# EAGLE design rStep_v3_seedstudio (EAGLE 5.10)
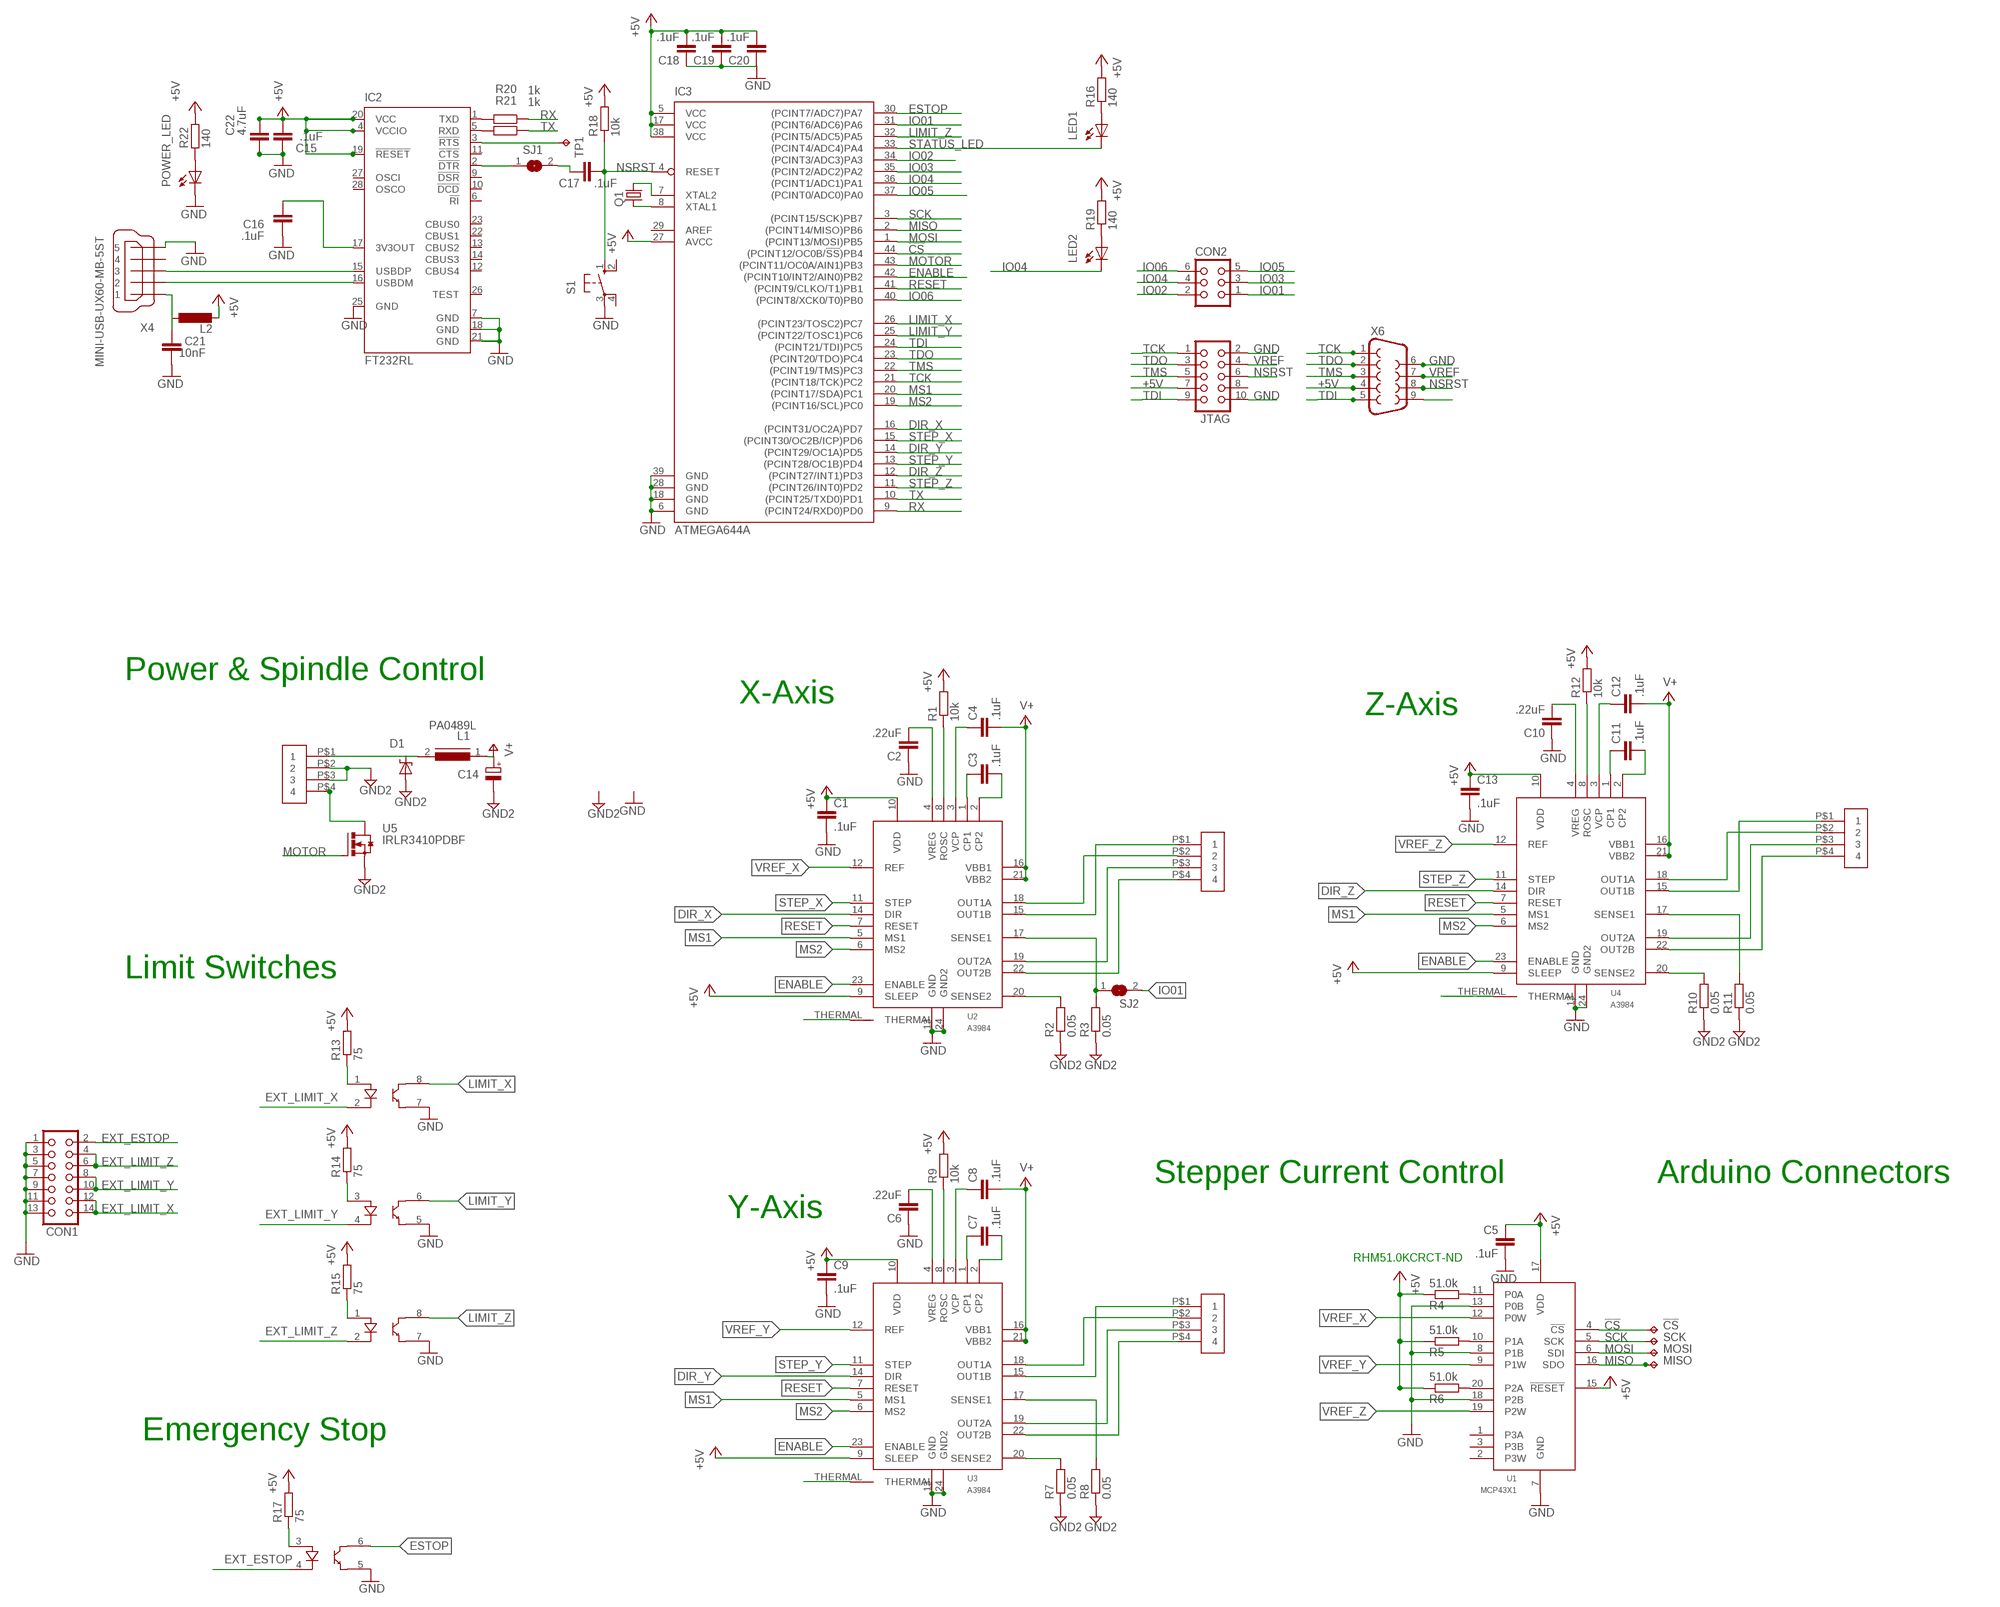
[diagram p0: schematic, sheet 1]

## Parts
!CS  TPB1,27  [B1,27]
C1  .1uF  C-EUC0805  [C0805]
C2  .22uF  C-EUC0805  [C0805]
C3  .1uF  C-EUC0805  [C0805]
C4  .1uF  C-EUC0805  [C0805]
C5  .1uF  C-EUC0805  [C0805]
C6  .22uF  C-EUC0805  [C0805]
C7  .1uF  C-EUC0805  [C0805]
C8  .1uF  C-EUC0805  [C0805]
C9  .1uF  C-EUC0805  [C0805]
C10  .22uF  C-EUC0805  [C0805]
C11  .1uF  C-EUC0805  [C0805]
C12  .1uF  C-EUC0805  [C0805]
C13  .1uF  C-EUC0805  [C0805]
C14  CPOL-EUE5-10.5  [E5-10,5]
C15  .1uF  C-EUC0805  [C0805]
C16  .1uF  C-EUC0805  [C0805]
C17  .1uF  C-EUC0805  [C0805]
C18  .1uF  C-EUC0805  [C0805]
C19  .1uF  C-EUC0805  [C0805]
C20  .1uF  C-EUC0805  [C0805]
C21  10nF  C-EUC0805  [C0805]
C22  4.7uF  C-EUC0805  [C0805]
CON1  CON14  [CON14]
CON2  CON06  [CON06]
D1  SUPPRESSOR-SMBJ  [SMBJ]
IC2  FT232RL  [SSOP28]
IC3  ATMEGA644A  [TQFP44]
JTAG  CON10  [CON10]
L1  PA0489L  [PA0489L]
L2  L-EUL2012C  [L2012C]
LED1  LEDCHIP-LED0805  [CHIP-LED0805]
LED2  LEDCHIP-LED0805  [CHIP-LED0805]
MISO  TPB1,27  [B1,27]
MOSI  TPB1,27  [B1,27]
POWER_LED  LEDCHIP-LED0805  [CHIP-LED0805]
Q1  CRYSTAL  [CSTCE_V_C]
R1  10k  R-EU_R0805  [R0805]
R2  0.05  R-EU_R0805  [R0805]
R3  0.05  R-EU_R0805  [R0805]
R4  51.0k  R-EU_R0805  [R0805]
R5  51.0k  R-EU_R0805  [R0805]
R6  51.0k  R-EU_R0805  [R0805]
R7  0.05  R-EU_R0805  [R0805]
R8  0.05  R-EU_R0805  [R0805]
R9  10k  R-EU_R0805  [R0805]
R10  0.05  R-EU_R0805  [R0805]
R11  0.05  R-EU_R0805  [R0805]
R12  10k  R-EU_R0805  [R0805]
R13  75  R-EU_R0805  [R0805]
R14  75  R-EU_R0805  [R0805]
R15  75  R-EU_R0805  [R0805]
R16  140  R-EU_R0805  [R0805]
R17  75  R-EU_R0805  [R0805]
R18  10k  R-EU_R0805  [R0805]
R19  140  R-EU_R0805  [R0805]
R20  1k  R-EU_R0805  [R0805]
R21  1k  R-EU_R0805  [R0805]
R22  140  R-EU_R0805  [R0805]
S1  10-XX  [B3F-10XX]
SCK  TPB1,27  [B1,27]
SJ1  SJ  [SJ]
SJ2  SJ  [SJ]
TP1  TPB2,54  [B2,54]
U1  MCP43X1  [TSSOP20]
U2  A3984  [TSSOP24]
U3  A3984  [TSSOP24]
U4  A3984  [TSSOP24]
U5  IRLR3410PDBF  [TO252]
U6  LTV-827S  [ISOLATOR_8PIN]
U7  LTV-827S  [ISOLATOR_8PIN]
X1  284392-4  [284392-4]
X2  284392-4  [284392-4]
X3  284392-4  [284392-4]
X4  MINI-USB-UX60-MB-5ST  [UX60-MB-5ST]
X5  OSTTC04262  [OSTTC042162]
X6  F09D  [F09D]

## Nets
!CS: !CS.TP IC3.44((PCINT12/OC0B/!SS!)PB4) U1.4(!CS)
+5V: C1.1 C5.1 C9.1 C13.1 C15.2 C18.2 C19.2 C20.2 C22.1 IC2.4(VCCIO) IC2.19(!RESET) IC2.20(VCC) IC3.5(VCC) IC3.17(VCC) IC3.27(AVCC) IC3.38(VCC) JTAG.7 L2.2 R1.2 R4.1 R5.1 R6.1 R9.2 R12.2 R13.2 R14.2 R15.2 R16.2 R17.2 R18.2 R19.2 R22.2 U1.15(!RESET) U1.17(VDD) U2.9(SLEEP) U2.10(VDD) U3.9(SLEEP) U3.10(VDD) U4.9(SLEEP) U4.10(VDD) X6.4
DIR_X: IC3.16((PCINT31/OC2A)PD7) U2.14(DIR)
DIR_Y: IC3.14((PCINT29/OC1A)PD5) U3.14(DIR)
DIR_Z: IC3.12((PCINT27/INT1)PD3) U4.14(DIR)
ENABLE: IC3.42((PCINT10/INT2/AIN0)PB2) U2.23(ENABLE) U3.23(ENABLE) U4.23(ENABLE)
ESTOP: IC3.30((PCINT7/ADC7)PA7) U7.6(C)
EXT_ESTOP: CON1.2 U7.4(K)
EXT_LIMIT_X: CON1.12 CON1.14 U6.2(K)
EXT_LIMIT_Y: CON1.8 CON1.10 U6.4(K)
EXT_LIMIT_Z: CON1.4 CON1.6 U7.2(K)
GND: C1.2 C2.1 C5.2 C6.1 C9.2 C10.1 C13.2 C15.1 C16.1 C18.1 C19.1 C20.1 C21.1 C22.2 CON1.1 CON1.3 CON1.5 CON1.7 CON1.9 CON1.11 CON1.13 IC2.7(GND) IC2.18(GND) IC2.21(GND) IC2.25(GND) IC3.6(GND) IC3.18(GND) IC3.28(GND) IC3.39(GND) JTAG.2 JTAG.10 POWER_LED.C S1.3(P) U1.7(GND) U1.8(P1B) U1.13(P0B) U1.18(P2B) U2.13(GND) U2.24(GND2) U3.13(GND) U3.24(GND2) U4.13(GND) U4.24(GND2) U6.5(E) U6.7(E) U7.5(E) U7.7(E) X4.5 X6.6
GND2: C14.- D1.A R2.1 R3.1 R7.1 R8.1 R10.1 R11.1 U5.2(S) X5.P$2 X5.P$3
IO01: CON2.1 IC3.31((PCINT6/ADC6)PA6) SJ2.2
IO02: CON2.2 IC3.34((PCINT3/ADC3)PA3)
IO03: CON2.3 IC3.35((PCINT2/ADC2)PA2)
IO04: CON2.4 IC3.36((PCINT1/ADC1)PA1) LED2.C
IO05: CON2.5 IC3.37((PCINT0/ADC0)PA0)
IO06: CON2.6 IC3.40((PCINT8/XCK0/T0)PB0)
LIMIT_X: IC3.26((PCINT23/TOSC2)PC7) U6.8(C)
LIMIT_Y: IC3.25((PCINT22/TOSC1)PC6) U6.6(C)
LIMIT_Z: IC3.32((PCINT5/ADC5)PA5) U7.8(C)
MISO: IC3.2((PCINT14/MISO)PB6) MISO.TP U1.16(SDO)
MOSI: IC3.1((PCINT13/MOSI)PB5) MOSI.TP U1.6(SDI)
MOTOR: IC3.43((PCINT11/OC0A/AIN1)PB3) U5.1(G)
MS1: IC3.20((PCINT17/SDA)PC1) U2.5(MS1) U3.5(MS1) U4.5(MS1)
MS2: IC3.19((PCINT16/SCL)PC0) U2.6(MS2) U3.6(MS2) U4.6(MS2)
N$1: C2.2 U2.4(VREG)
N$2: C3.1 U2.1(CP1)
N$3: C3.2 U2.2(CP2)
N$4: C4.1 U2.3(VCP)
N$5: U2.18(OUT1A) X1.P$2
N$6: U2.15(OUT1B) X1.P$1
N$7: U2.19(OUT2A) X1.P$3
N$8: U2.22(OUT2B) X1.P$4
N$9: R1.1 U2.8(ROSC)
N$10: C6.2 U3.4(VREG)
N$11: C7.1 U3.1(CP1)
N$12: C7.2 U3.2(CP2)
N$13: C8.1 U3.3(VCP)
N$14: U3.18(OUT1A) X2.P$2
N$15: U3.15(OUT1B) X2.P$1
N$16: C17.2 SJ1.2
N$17: R2.2 U2.20(SENSE2)
N$18: U3.19(OUT2A) X2.P$3
N$19: R4.2 U1.11(P0A)
N$20: R5.2 U1.10(P1A)
N$21: R6.2 U1.20(P2A)
N$22: U3.22(OUT2B) X2.P$4
N$23: R8.2 U3.17(SENSE1)
N$24: R7.2 U3.20(SENSE2)
N$25: R9.1 U3.8(ROSC)
N$26: C10.2 U4.4(VREG)
N$27: C11.1 U4.1(CP1)
N$28: C11.2 U4.2(CP2)
N$29: C12.1 U4.3(VCP)
N$30: U4.18(OUT1A) X3.P$2
N$31: U4.15(OUT1B) X3.P$1
N$32: U4.19(OUT2A) X3.P$3
N$33: U4.22(OUT2B) X3.P$4
N$34: R11.2 U4.17(SENSE1)
N$35: R10.2 U4.20(SENSE2)
N$36: R12.1 U4.8(ROSC)
N$37: LED1.A R16.1
N$38: D1.C L1.2 X5.P$1
N$39: R13.1 U6.1(A)
N$40: C21.2 L2.1 X4.1
N$41: R14.1 U6.3(A)
N$42: IC2.16(USBDM) X4.2
N$43: R15.1 U7.1(A)
N$45: IC2.15(USBDP) X4.3
N$46: X6.9
N$47: R17.1 U7.3(A)
N$48: LED2.A R19.1
N$49: C16.2 IC2.17(3V3OUT)
N$50: U5.3(D) X5.P$4
N$52: IC2.3(!RTS) TP1.TP
N$53: IC2.2(!DTR) SJ1.1
N$54: IC2.1(TXD) R20.2
N$55: IC2.5(RXD) R21.2
N$56: POWER_LED.A R22.1
N$57: IC3.8(XTAL1) Q1.P$1
N$58: IC3.7(XTAL2) Q1.P$3
NSRST: C17.1 IC3.4(RESET) JTAG.6 R18.1 S1.1(S) X6.8
RESET: IC3.41((PCINT9/CLKO/T1)PB1) U2.7(RESET) U3.7(RESET) U4.7(RESET)
RX: IC3.9((PCINT24/RXD0)PD0) R20.1
SCK: IC3.3((PCINT15/SCK)PB7) SCK.TP U1.5(SCK)
SENSE1_LEFT: R3.2 SJ2.1 U2.17(SENSE1)
STATUS_LED: IC3.33((PCINT4/ADC4)PA4) LED1.C
STEP_X: IC3.15((PCINT30/OC2B/ICP)PD6) U2.11(STEP)
STEP_Y: IC3.13((PCINT28/OC1B)PD4) U3.11(STEP)
STEP_Z: IC3.11((PCINT26/INT0)PD2) U4.11(STEP)
TCK: IC3.21((PCINT18/TCK)PC2) JTAG.1 X6.1
TDI: IC3.24((PCINT21/TDI)PC5) JTAG.9 X6.5
TDO: IC3.23((PCINT20/TDO)PC4) JTAG.3 X6.2
THERMAL: U2.THERMAL U3.THERMAL U4.THERMAL
TMS: IC3.22((PCINT19/TMS)PC3) JTAG.5 X6.3
TX: IC3.10((PCINT25/TXD0)PD1) R21.1
V+: C4.2 C8.2 C12.2 C14.+ L1.1 U2.16(VBB1) U2.21(VBB2) U3.16(VBB1) U3.21(VBB2) U4.16(VBB1) U4.21(VBB2)
VREF: JTAG.4 X6.7
VREF_X: U1.12(P0W) U2.12(REF)
VREF_Y: U1.9(P1W) U3.12(REF)
VREF_Z: U1.19(P2W) U4.12(REF)
Unconnected: IC2.6(!RI) IC2.9(!DSR) IC2.10(!DCD) IC2.11(!CTS) IC2.12(CBUS4) IC2.13(CBUS2) IC2.14(CBUS3) IC2.22(CBUS1) IC2.23(CBUS0) IC2.26(TEST) IC2.27(OSCI) IC2.28(OSCO) IC3.29(AREF) JTAG.8 S1.2(S1) S1.4(P1) U1.1(P3A) U1.2(P3W) U1.3(P3B) X4.4

## Notes on the sheet
- Power & Spindle Control
- X-Axis
- Z-Axis
- Limit Switches
- Stepper Current Control | Arduino Connectors
- Y-Axis
- RHM51.0KCRCT-ND
- Emergency Stop

## Library data of the parts
!CS MISO MOSI SCK TP1 = testpad:TP: Test pad
C1-C13 C15-C22 = rcl:C-EU: CAPACITOR, European symbol
C14 = rcl:CPOL-EU: POLARIZED CAPACITOR, European symbol
CON1 = con-harting:CON14: CONNECTOR
CON2 = con-harting:CON06: CONNECTOR
D1 = diode:SUPPRESSOR-: Suppressor diode
IC2 = ftdichip:FT232R: Source: http://www.ftdichip.com/Documents/DataSheets/DS_FT232R_v104.pdf
IC3 = rStep:ATMEGA644: 8-bit Microcontroller with 64K Bytes In-System Programmable Flash Source: http://www.atmel.com/dyn/resources/prod_documents/doc2593.pdf
JTAG = con-harting:CON10: CONNECTOR
L1 = rStep:PA0489L
L2 = rcl:L-EU: INDUCTOR, European symbol
LED1 LED2 POWER_LED = led:LED: LED OSRAM: - CHIPLED LG R971, LG N971, LY N971, LG Q971, LY Q971, LO R971, LY R971 LH N974, LH R974 LS Q976, LO Q976, LY Q976 LO Q996 - Hyper CHIPLED LW Q18S LB Q993, LB Q99A, LB R99A - SideLED LS A670, LO A670, LY A670, LG A670, LP A670 LB A673, LV A673, LT A673, LW A673 LH A674 LY A675 LS A676, LA A676, LO A676, LY A676, LW A676 LS A679, LY A679, LG A679 - Hyper Micro SIDELED® LS Y876, LA Y876, LO Y876, LY Y876 LT Y87S - SmartLED LW L88C, LW L88S LB L89C, LB L89S, LG L890 LS L89K, LO L89K, LY L89K LS L896, LA L896, LO L896, LY L896 - TOPLED LS T670, LO T670, LY T670, LG T670, LP T670 LSG T670, LSP T670, LSY T670, LOP T670, LYG T670 LG T671, LOG T671, LSG T671 LB T673, LV T673, LT T673, LW T673 LH T674 LS T676, LA T676, LO T676, LY T676, LB T676, LH T676, LSB T676, LW T676 LB T67C, LV T67C, LT T67C, LS T67K, LO T67K, LY T67K, LW E67C LS E67B, LA E67B, LO E67B, LY E67B, LB E67C, LV E67C, LT E67C LW T67C LS T679, LY T679, LG T679 LS T770, LO T770, LY T770, LG T770, LP T770 LB T773, LV T773, LT T773, LW T773 LH T774 LS E675, LA E675, LY E675, LS T675 LS T776, LA T776, LO T776, LY T776, LB T776 LHGB T686 LT T68C, LB T68C - Hyper Mini TOPLED® LB M676 - Mini TOPLED Santana® LG M470 LS M47K, LO M47K, LY M47K Source: http://www.osram.convergy.de LUXEON: - LUMILED® LXK2-PW12-R00, LXK2-PW12-S00, LXK2-PW14-U00, LXK2-PW14-V00 LXK2-PM12-R00, LXK2-PM12-S00, LXK2-PM14-U00 LXK2-PE12-Q00, LXK2-PE12-R00, LXK2-PE12-S00, LXK2-PE14-T00, LXK2-PE14-U00 LXK2-PB12-K00, LXK2-PB12-L00, LXK2-PB12-M00, LXK2-PB14-N00, LXK2-PB14-P00, LXK2-PB14-Q00 LXK2-PR12-L00, LXK2-PR12-M00, LXK2-PR14-Q00, LXK2-PR14-R00 LXK2-PD12-Q00, LXK2-PD12-R00, LXK2-PD12-S00 LXK2-PH12-R00, LXK2-PH12-S00 LXK2-PL12-P00, LXK2-PL12-Q00, LXK2-PL12-R00 Source: www.luxeon.com KINGBRIGHT: KA-3528ASYC Source: www.kingbright.com
Q1 = rStep:CRYSTAL: CRYSTAL
R1-R22 = rcl:R-EU_: RESISTOR, European symbol
S1 = switch-omron:10-XX: OMRON SWITCH
SJ1 SJ2 = jumper:SJ: SMD solder JUMPER
U1 = rStep:MCP43X1
U2-U4 = rStep:A3984
U5 = rStep:IRLR3410PDBF
U6 U7 = rStep:LTV-827S
X1-X3 = rStep:284392-4
X4 = con-hirose:MINI-USB-: MINI USB Connector Source: http://www.hirose.co.jp/cataloge_hp/e24000019.pdf
X5 = rStep:OSTTC04262
X6 = con-subd:F09: SUB-D

## Net classes
0 default: width 0.152 mm, drill 0.33 mm, clearance 0.152 mm
1 power: width 0.61 mm, drill 0.711 mm, clearance 0.33 mm
2 gnd: width 0.305 mm, drill 0.711 mm, clearance 0.254 mm
3 usbvcc: width 0.508 mm, drill 0.711 mm, clearance 0.254 mm
4 aref: width 0.406 mm

## Board
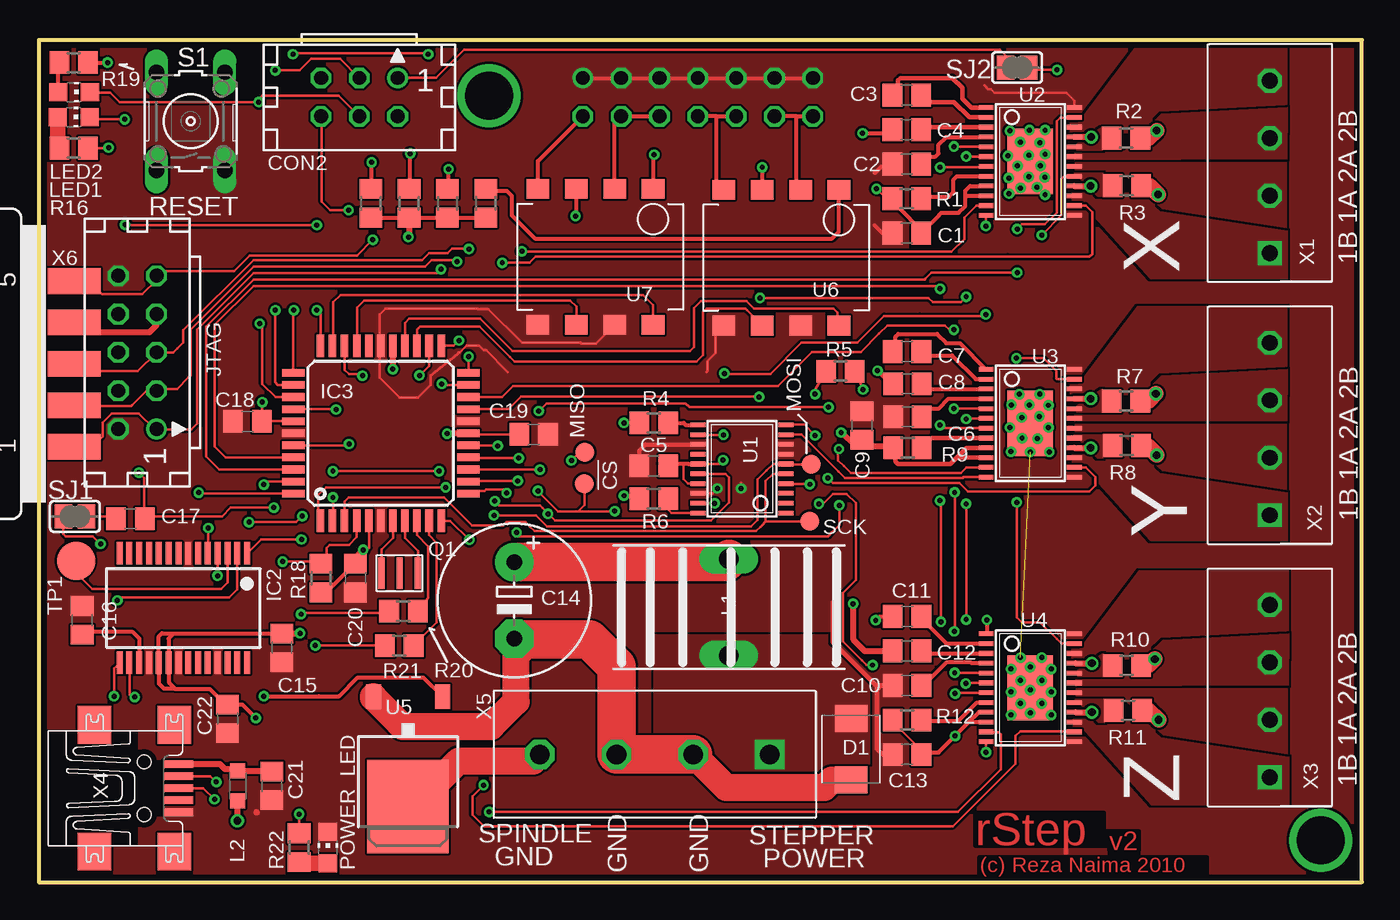
[diagram p1: board, top side]
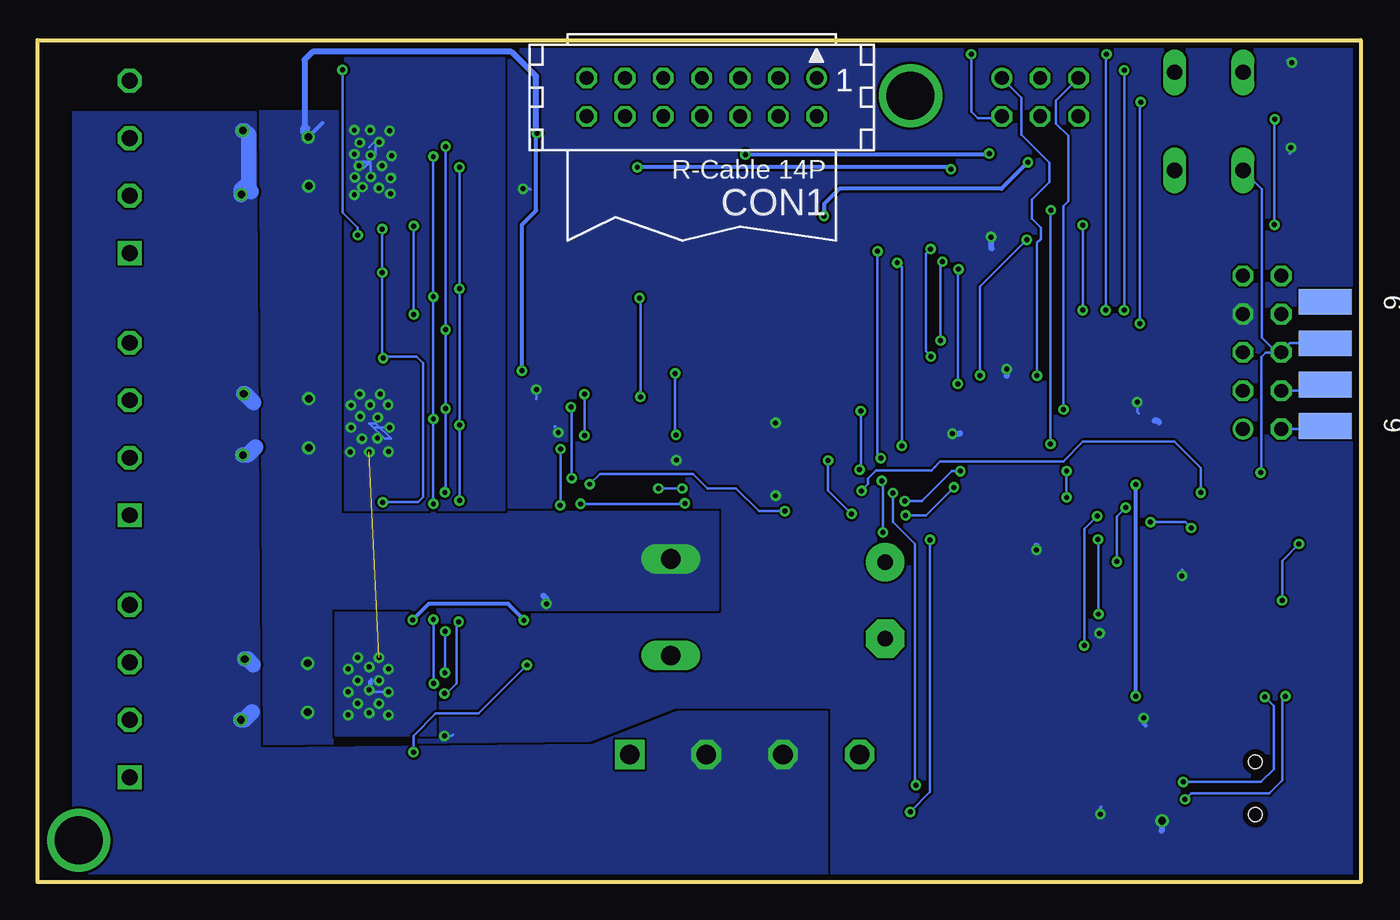
[diagram p2: board, bottom side, seen from below]

Size 87.66 x 55.8 mm. Coordinates in mm from the lower left corner, seen from the top.
Outline: 87.66,55.8 0,55.8 0,0 87.66,0 87.66,55.8
Copper layers (1*16): Top 0.0356mm / dielectric 1.5011mm / Bottom 0.0356mm
Design rules "LaenPCBOrder *": minimum track width 6mil, minimum drill 13mil, track to track 6mil, track to pad 6mil, pad to pad 6mil, via to via 6mil, smd to smd 0mil, copper to edge 15mil, drill to drill 6mil, minimum pad ring 7mil, minimum via ring 7mil, stop-mask expansion 4mil, vias tented up to drill 0mil, thermal gap 10mil

### Footprints (pad centres in the part's own frame; a part is rotated, then mirrored left to right if it is on the bottom)
B1,27 = smd 1.27 x 1.27: TP 0,0
C0805 = smd 1.3 x 1.5: 1 -0.95,0; 2 0.95,0
E5-10,5 = drill 1.016 pad 2.54 round: + -2.54,0 | drill 1.016 pad 2.54 octagon: - 2.54,0
CON14 = drill 0.914 round: 1 -7.62,-1.27 | drill 0.914 octagon: 2 -7.62,1.27; 3 -5.08,-1.27; 4 -5.08,1.27; 5 -2.54,-1.27; 6 -2.54,1.27; 7 0,-1.27; 8 0,1.27; 9 2.54,-1.27; 10 2.54,1.27; 11 5.08,-1.27; 12 5.08,1.27; 13 7.62,-1.27; 14 7.62,1.27
CON06 = drill 0.914 round: 1 -2.54,-1.27 | drill 0.914 octagon: 2 -2.54,1.27; 3 0,-1.27; 4 0,1.27; 5 2.54,-1.27; 6 2.54,1.27
SMBJ = smd 1.78 x 2.16: A 2.04,0; C -2.03,0
SSOP28 = smd 0.4 x 1.5: 1 -4.225,-3.625; 2 -3.575,-3.625; 3 -2.925,-3.625; 4 -2.275,-3.625; 5 -1.625,-3.625; 6 -0.975,-3.625; 7 -0.325,-3.625; 8 0.325,-3.625; 9 0.975,-3.625; 10 1.625,-3.625; 11 2.275,-3.625; 12 2.925,-3.625; 13 3.575,-3.625; 14 4.225,-3.625; 15 4.225,3.625; 16 3.575,3.625; 17 2.925,3.625; 18 2.275,3.625; 19 1.625,3.625; 20 0.975,3.625; 21 0.325,3.625; 22 -0.325,3.625; 23 -0.975,3.625; 24 -1.625,3.625; 25 -2.275,3.625; 26 -2.925,3.625; 27 -3.575,3.625; 28 -4.225,3.625
TQFP44 = smd 1.5 x 0.5: 1 -5.8,4; 2 -5.8,3.2; 3 -5.8,2.4; 4 -5.8,1.6; 5 -5.8,0.8; 6 -5.8,0; 7 -5.8,-0.8; 8 -5.8,-1.6; 9 -5.8,-2.4; 10 -5.8,-3.2; 11 -5.8,-4; 23 5.8,-4; 24 5.8,-3.2; 25 5.8,-2.4; 26 5.8,-1.6; 27 5.8,-0.8; 28 5.8,0; 29 5.8,0.8; 30 5.8,1.6; 31 5.8,2.4; 32 5.8,3.2; 33 5.8,4 | smd 0.5 x 1.5: 12 -4,-5.8; 13 -3.2,-5.8; 14 -2.4,-5.8; 15 -1.6,-5.8; 16 -0.8,-5.8; 17 0,-5.8; 18 0.8,-5.8; 19 1.6,-5.8; 20 2.4,-5.8; 21 3.2,-5.8; 22 4,-5.8; 34 4,5.8; 35 3.2,5.8; 36 2.4,5.8; 37 1.6,5.8; 38 0.8,5.8; 39 0,5.8; 40 -0.8,5.8; 41 -1.6,5.8; 42 -2.4,5.8; 43 -3.2,5.8; 44 -4,5.8
CON10 = drill 0.914 round: 1 -5.08,-1.27 | drill 0.914 octagon: 2 -5.08,1.27; 3 -2.54,-1.27; 4 -2.54,1.27; 5 0,-1.27; 6 0,1.27; 7 2.54,-1.27; 8 2.54,1.27; 9 5.08,-1.27; 10 5.08,1.27
PA0489L = drill 1.3 long: 1 -3.2,0; 2 3.2,0
L2012C = smd 1 x 1: 1 -1,0; 2 1,0
CHIP-LED0805 = smd 1.2 x 1.2: A 0,-1.05; C 0,1.05
CSTCE_V_C = smd 0.4 x 2.1: P$1 0,0; P$2 1.2,0; P$3 2.4,0
R0805 = smd 1.3 x 1.5: 1 -0.95,0; 2 0.95,0
B3F-10XX = drill 1.016 long: 1 -3.251,2.261; 2 3.251,2.261; 3 -3.251,-2.261; 4 3.251,-2.261
SJ = smd 1.168 x 1.6: 1 -0.762,0; 2 0.762,0
B2,54 = smd 2.54 x 2.54: TP 0,0
TSSOP20 = smd 0.305 x 0.991: 1 -2.925,-2.918; 2 -2.275,-2.918; 3 -1.625,-2.918; 4 -0.975,-2.918; 5 -0.325,-2.918; 6 0.325,-2.918; 7 0.975,-2.918; 8 1.625,-2.918; 9 2.275,-2.918; 10 2.925,-2.918; 11 2.925,2.918; 12 2.275,2.918; 13 1.625,2.918; 14 0.975,2.918; 15 0.325,2.918; 16 -0.325,2.918; 17 -0.975,2.918; 18 -1.625,2.918; 19 -2.275,2.918; 20 -2.925,2.918
TSSOP24 = smd 0.305 x 0.991: 1 -3.575,-2.918; 2 -2.925,-2.918; 3 -2.275,-2.918; 4 -1.625,-2.918; 5 -0.975,-2.918; 6 -0.325,-2.918; 7 0.325,-2.918; 8 0.975,-2.918; 9 1.625,-2.918; 10 2.275,-2.918; 11 2.925,-2.918; 12 3.575,-2.918; 13 3.575,2.918; 14 2.925,2.918; 15 2.275,2.918; 16 1.625,2.918; 17 0.975,2.918; 18 0.325,2.918; 19 -0.325,2.918; 20 -0.975,2.918; 21 -1.625,2.918; 22 -2.275,2.918; 23 -2.925,2.918; 24 -3.575,2.918 | smd 4.32 x 3: THERMAL 0,0
TO252 = smd 1 x 1.6: 1 -2.28,-4.8; 2 2.28,-4.8 | smd 5.4 x 6.2: 3 0,2.5
ISOLATOR_8PIN = smd 1.5 x 1.3: 1 0,-9; 2 2.54,-9; 3 5.08,-9; 4 7.62,-9; 5 7.62,0; 6 5.08,0; 7 2.54,0; 8 0,0
284392-4 = drill 1.05 square: P$1 0,0 | drill 1.05 octagon: P$2 3.81,0; P$3 7.62,0; P$4 11.43,0
UX60-MB-5ST = smd 2 x 0.5: 1 2.25,1.6; 2 2.25,0.8; 3 2.25,0; 4 2.25,-0.8; 5 2.25,-1.6 | smd 2.2 x 2.5: M1 -3.3,-4.2; M2 -3.3,4.2; M3 2,4.2; M4 2,-4.2 | hole 0.9: 0,-1.75; 0,1.75
OSTTC042162 = drill 1.3 square: P$1 0,0 | drill 1.3 octagon: P$2 5.08,0; P$3 10.16,0; P$4 15.24,0
F09D = smd 1.7 x 3.5: 1 -5.486,-6.045; 2 -2.743,-6.045; 3 0,-6.045; 4 2.743,-6.045; 5 5.486,-6.045 | smd 1.7 x 3.5 bottom: 6 -4.115,-6.045; 7 -1.372,-6.045; 8 1.372,-6.045; 9 4.115,-6.045

### Placement (x,y rotation side)
!CS  36.14,26.39 0 top
C1  57.51,43 180 top
C2  57.51,47.57 0 top
C3  57.51,52.15 0 top
C4  57.51,49.86 180 top
C5  40.74,27.58 180 top
C6  57.56,30.84 0 top
C7  57.53,35.15 0 top
C8  57.56,33.02 180 top
C9  54.53,30.25 90 top
C10  57.53,13.03 0 top
C11  57.53,17.6 0 top
C12  57.53,15.32 180 top
C13  57.53,8.46 180 top
C14  31.5,18.67 270 top
C15  16.1,15.52 90 top
C16  2.87,17.35 270 top
C17  6.07,24.08 180 top
C18  13.82,30.53 0 top
C19  32.79,29.67 180 top
C20  20.98,20.14 90 top
C21  15.44,6.38 90 top
C22  12.5,10.82 270 top
CON1  43.66,52.02 180 bottom
CON2  21.23,52.02 180 top
D1  53.82,8.81 270 top
IC2  9.58,18.16 180 top
IC3  22.66,29.74 90 top
JTAG  6.53,35.1 90 top
L1  45.72,18.21 270 top
L2  13.18,6.38 270 top
LED1  2.31,50.7 270 top
LED2  2.34,52.35 270 top
MISO  36.17,28.5 0 top
MOSI  51.18,27.69 0 top
POWER_LED  19.15,2.29 0 top
Q1  25.1,20.47 180 top
R1  57.51,45.29 180 top
R2  72.03,49.3 180 top
R3  72.09,46.15 180 top
R4  40.74,30.43 0 top
R5  53.11,33.86 180 top
R6  40.74,25.4 0 top
R7  72.03,31.88 180 top
R8  72.09,28.93 180 top
R9  57.56,28.78 180 top
R10  72.09,14.35 180 top
R11  72.16,11.38 180 top
R12  57.53,10.74 180 top
R13  29.62,44.98 270 top
R14  27.08,44.98 270 top
R15  24.54,44.98 270 top
R16  2.31,48.64 0 top
R17  22,44.98 270 top
R18  18.69,20.14 270 top
R19  2.31,54.31 0 top
R20  24.16,17.96 180 top
R21  23.88,15.67 180 top
R22  17.25,2.29 90 top
S1  10.06,50.42 90 top
SCK  51.08,23.9 0 top
SJ1  2.39,24.23 0 top
SJ2  64.82,53.98 180 top
TP1  2.46,21.29 0 top
U1  46.58,27.38 90 top
U2  65.68,47.75 270 top
U3  65.68,30.4 270 top
U4  65.68,12.88 270 top
U5  24.46,7.49 180 top
U6  53.01,36.88 180 top
U7  40.69,36.93 180 top
X1  81.56,41.68 90 top
X2  81.56,24.31 90 top
X3  81.56,6.93 90 top
X4  6.98,6.22 0 top
X5  48.44,8.46 180 top
X6  -3.71,34.34 90 top

### Tracks (layer width: path | path; a pad name or v marks a point on that pad's centre or on a via)
!CS  (via drill 0.33)
  Top 0.152: v33.07,25.93 33.07,25.88 34.39,24.56 35.71,24.56 | 35.71,24.56 38.13,24.56 v38.15,24.59 | v51.08,26.37 49.54,26.37 U1.4 | !CS.TP 36.14,24.99 35.71,24.56 | IC3.44 10.65,25.74 v10.59,25.81
  Bottom 0.152: v33.07,25.93 32.64,26.37 32.64,26.75 32.11,27.28 28.45,27.28 28.21,27.52 27.86,27.86 19.71,27.86 18.39,29.18 12.34,29.18 10.59,27.43 v10.59,25.81 | v38.15,24.59 39.88,24.59 41.38,26.09 43.28,26.09 44.25,27.05 50.39,27.05 v51.08,26.37
+5V  (via drill 0.33, 0.51)
  Top 0.152: 14.78,30.54 IC3.38 | C18.2 14.78,30.54 | C19.2 28.53,29.67 IC3.17 | IC3.5 21.89,23.91 21.89,22.15 20.98,21.23 C20.2 20.94,21.09 20.52,20.68 | R6.1 38.79,25.58 v38.76,25.6 | R4.1 v38.76,30.43 | U1.15 45.09,27.71 v45.34,27.97 | R5.1 54.62,32.65 v54.61,32.64 | R1.2 56.16,45.29 v55.5,45.95 | U1.17 43.01,26.41 42.7,26.72 42.7,27.71 42.72,27.74 | 58.61,8.59 58.6,8.59 57.07,10.11 57.07,10.25 R12.2 | 41.2,27.71 41.56,27.71 C5.1 | IC2.4 11.85,20.46 v11.84,20.29 | 14.78,30.54 14.78,31.77 v14.81,31.8 | 3.51,36.45 3.12,36.83 2.59,36.83 X6.4 | R22.2 v17.25,4.5 | R16.2 4.6,48.64 v4.62,48.67 | R9.2 56.77,28.82 | 60.64,27.95 60.82,28.13 | 54.88,28.91 C9.1 54.16,29.02
  Top 0.254: U2.9 61.7,46.13 61.39,45.82 61.39,45.34 | 61.39,45.34 61.39,44.81 60.93,44.35 59.79,44.35 59.66,44.22 59.66,44.21 C1.1 58.46,43.22 56.97,44.7 56.97,44.87 R1.2 | U2.10 61.53,45.48 61.39,45.34 | U1.15 43.03,27.71 43,27.74 42.72,27.74 41.17,27.74 41.2,27.71 | R4.1 39.56,30.66 | R13.2 R14.2 R15.2 R17.2 | R18.2 19.04,19.19 20.52,20.68 | 61.63,10.6 U4.10 | 61.63,10.6 v60.71,9.68 59.61,8.59 58.61,8.59 C13.1 | U4.9 62.28,11.25 61.63,10.6 | 8.99,12.85 8.64,13.21 8.64,14.5 IC2.20 8.6,16.14 8.89,16.43 16.07,16.43 C15.2 16.09,16.48 8.15,16.48 7.95,16.28 IC2.19 7.95,13.16 8.28,12.83 8.99,12.83 8.99,12.85 | 8.99,12.85 9.04,12.8 11.33,12.8 12.36,11.77 C22.1 13.48,11.77 v14.38,10.87 | R19.2 v4.55,54.31
  Top 0.305: U3.9 61.47,28.78 60.64,27.95 60.4,27.71 56.92,27.71 56.77,27.86 56.77,28.82 | 60.82,28.13 U3.10
  Top 0.406: R15.2 24.54,42.8 v24.49,42.75 | IC3.17 27.08,29.74 v27.05,29.72 | IC3.27 23.46,34 v23.44,33.99 | 16.07,16.43 16.09,16.47 v17.3,16.48 | C20.2 20.98,21.51 v21.49,22.02 | JTAG.7 7.8,36.91 7.34,36.45 3.51,36.45 | L2.2 13.18,4.09 v13.16,4.06 | 54.88,28.91 56.57,28.91 56.61,28.86 R9.2 | v53.16,29.79 54.1,28.93 54.16,28.99 54.16,29.02
  Bottom 0.152: v38.76,25.6 38.76,25.83 38.68,25.91 | v38.76,30.43 38.58,30.43 | v45.34,27.97 45.34,28.12 45.36,28.14 | v54.61,32.64 54.61,32.03 54.64,32 | v55.5,45.95 55.07,45.95 55.02,45.9 | v60.71,9.68 60.22,9.68 60.15,9.75 | v11.84,20.29 11.81,20.68 11.84,20.7 | v14.81,31.8 14.81,31.14 14.71,31.04 | v17.25,4.5 17.25,4.95 17.22,4.98 17.2,4.98 | v4.62,48.67 4.62,48.34 4.7,48.26 | v53.16,29.79 53.42,30.2 53.39,30.23
  Bottom 0.254: v14.38,10.87 14.38,10.49 14.25,10.36 | v4.55,54.31 4.72,54.31 4.83,54.41
  Bottom 0.406: v24.49,42.75 24.49,42.04 24.46,42.01 | 13.67,30.58 13.46,30.58 13.36,30.48 | v27.05,29.72 26.57,29.72 26.54,29.74 | v23.44,33.99 23.44,33.58 23.47,33.55 | v21.49,22.02 21.49,22.28 21.46,22.3 | v13.16,4.06 13.16,3.45 13.18,3.43
  pour Bottom (rank 3, no thermals): 0.64,55.73 63.68,55.73 63.68,-0.03 0.64,-0.03
DIR_X  (via drill 0.33)
  Top 0.152: IC3.16 30.37,28.94 v30.4,28.91 | v30.71,41.05 32.51,41.05 32.92,41.45 64.19,41.45 69.62,41.45 69.8,41.63 69.8,43.64 69.8,44.4 69.37,44.83 U2.14
  Bottom 0.152: v30.4,28.91 30.4,40.74 v30.71,41.05
DIR_Y  (via drill 0.33)
  Top 0.152: U3.14 69.37,27.48 70,26.85 70,26.29 69.6,25.88 61.75,25.88 61.57,25.88 61.01,26.44 52.6,26.44 v52.27,26.77 | v52.32,31.47 43.1,31.47 42.85,31.72 33.63,31.72 v33.12,31.22 | v33.2,27.33 28.47,27.33 IC3.14
  Bottom 0.152: v52.27,26.77 52.27,31.42 v52.32,31.47 | v33.12,31.22 33.12,27.41 v33.2,27.33
DIR_Z  (via drill 0.33)
  Top 0.152: IC3.12 28.62,25.91 29.03,25.91 29.54,25.91 29.64,26.01 30.73,26.01 30.76,26.01 v30.99,25.78 | v29.46,6.43 28.73,5.69 28.73,4.47 29.49,3.71 60.58,3.71 64.72,7.85 64.72,9.68 65.02,9.98 68.57,9.98 U4.14
  Bottom 0.152: v30.99,25.78 30.99,23.85 29.54,22.4 29.54,6.5 v29.46,6.43
ENABLE  (via drill 0.33)
  Top 0.152: U4.23 67.74,15.8 67.44,16.1 66.32,17.22 65.13,17.22 64.8,17.55 v64.8,25.17 | U2.23 67.69,50.67 67.44,50.42 67.44,44.37 66.65,43.59 65.13,43.59 v64.82,43.28 | U3.23 67.46,33.33 67.44,33.35 67.41,33.38 67.41,33.86 66.55,34.72 v64.77,34.72 | v64.82,40.39 59.16,40.39 58.75,39.98 58.7,39.93 14.22,39.93 11.1,36.8 11.1,36.6 11.1,28.19 11.95,27.34 IC3.42
  Bottom 0.152: 64.82,39.85 64.82,34.77 v64.77,34.72 64.67,34.82 62.56,34.82 62.13,34.39 62.13,25.53 62.46,25.2 64.77,25.2 v64.8,25.17 | v64.82,40.39 64.82,39.85 | v64.82,40.39 v64.82,43.28 | v64.82,40.39 64.82,39.85
ESTOP
  Top 0.152: U7.6 35.61,37.82 35.61,38.13 35.2,38.53 21.54,38.53 21.08,38.07 21.08,37.62 21.08,35.57 IC3.30
EXT_ESTOP
  Top 0.254: CON1.2 33.07,47.78 U7.4
EXT_LIMIT_X
  Top 0.254: 50.19,50.75 CON1.12 | 50.19,50.75 CON1.14 | U6.2 50.19,46.16 50.19,50.75
EXT_LIMIT_Y
  Top 0.254: 44.91,50.75 CON1.8 | 44.91,50.75 CON1.10 | U6.4 44.91,46.36 44.91,50.75
EXT_LIMIT_Z
  Top 0.254: U7.2 38.15,50.32 CON1.4 CON1.6
GND  (via drill 0.33)
  Top 0.152: U1.18 44.63,25.76 v44.96,26.09 | v46.53,26.09 46.53,26.44 | U2.24 68.6,51.77 68.07,52.3 63.32,52.3 63.07,52.55 62.89,52.55 62.64,52.81 | U7.7 36.91,35.69 35.94,35.69 35.89,35.74 32,35.74 29.77,37.97 29.11,37.97 29.08,38 22.96,38 22.58,37.62 22.58,36.09 22.58,33.43 23.9,32.11 25.12,32.11 25.96,32.94 25.96,33.55 27.71,34.95 27.81,35.08 27.86,35.08 28.35,35.56 29.16,35.56 29.46,35.26 29.62,35.26 31.06,33.81 | 44.25,33.81 44.3,33.86 44.3,34.52 44.83,35.05 44.83,36.32 U6.5
  Top 0.254: C1.2 55.91,43 55.4,43.51 | 55.4,46.99 55.83,47.42 56.4,47.42 C2.1 | CON1.1 CON1.13 | U1.13 | U1.13 40.18,29.01 39.79,28.62 C5.2
  Top 0.305: C13.2 55.91,8.46 55.52,8.84 55.52,12.75 | 55.52,12.75 55.52,12.95 52.6,15.88 52.6,18.57 | C10.1 55.8,13.03 55.52,12.75
  Top 0.406: 14.4,4.62 14.45,4.62
  Bottom 0.152: v44.96,26.09 v46.53,26.09 | JTAG.2 2.54,30.02 X6.6
  pour Top (rank 4, no thermals): 0.69,55.8 63.55,55.8 87.96,56.08 87.73,0.1 0.69,0.05
GND2  (via drill 0.51)
  Top 1.016: R2.1 73.56,49.3 v74.07,49.81 | R3.1 73.58,46.15 v74.17,45.57 | R7.1 73.53,31.88 v74.02,32.36 | R8.1 73.43,28.93 v74.07,28.3 | R10.1 73.51,14.35 v73.94,14.78 | R11.1 73.56,11.38 v74.19,10.74
  Top 1.778: D1.A 52.54,6.77 52.04,6.27 45.54,6.27 X5.P$2 | U5.2 22.18,12.24 23.9,10.52 24.1,10.31 29.97,10.31 31.62,11.96 31.62,15.04 31.85,15.27 31.85,15.77 C14.-
  Top 2.54: C14.- 31.55,16.08 36.5,16.08 38.28,14.3 X5.P$3 X5.P$2
  Bottom 1.016: v74.07,49.81 73.96,49.81 73.69,49.53 73.69,46.36 | 73.69,46.36 73.69,45.92 73.51,45.75 | v74.17,45.57 74.17,45.87 73.69,46.36 | v74.02,32.36 73.94,32.36 73.36,31.78 | v74.07,28.3 73.74,28.3 73.2,28.83 | v73.94,14.78 73.76,14.78 73.38,14.4 | v74.19,10.74 73.96,10.74 73.43,11.28
  pour Bottom (no thermals): 73.2,51.03 85.32,51.03 85.32,0.18 35.36,0.18 35.36,11.28 45.26,11.28 50.85,9.09 72.95,8.86
IO01  (via drill 0.33)
  Top 0.152: IC3.31 20.26,33.95 20.55,33.66 21.34,33.66 v21.44,33.55 | CON2.1 23.8,53.31 26.31,53.31 28.17,55.17 63.68,55.17 64.24,54.61 64.24,54.41 63.98,54.15 63.98,54.05 SJ2.2
  Bottom 0.152: v21.44,33.55 21.44,42.37 21.18,42.62 21.18,43.38 21.77,43.97 21.77,45.24 20.62,46.38 20.62,47.68 22.48,49.53 22.48,51.99 CON2.1
IO02  (via drill 0.33)
  Top 0.152: IC3.34 16.86,37.86 v16.89,37.9 | v16.84,54.86 16.84,54.91 25.76,54.91 v25.81,54.86
  Bottom 0.152: v16.89,37.9 16.89,54.81 v16.84,54.86 | v25.81,54.86 25.81,51.05 25.37,50.62 23.9,50.62 CON2.2
IO03  (via drill 0.33)
  Top 0.152: IC3.35 15.82,32.94 15.65,33.12 15.65,37.87 v15.67,37.9 | v15.67,53.8 16.99,53.8 17.27,53.8 18.03,54.56 19.96,54.56 CON2.3
  Bottom 0.152: v15.67,37.9 v15.67,53.8
IO04  (via drill 0.33)
  Top 0.152: IC3.36 15.68,32.14 14.81,33.02 14.81,36.83 v14.63,37.01 | CON2.4 19.86,52.12 14.81,52.12 14.58,51.89 v14.58,51.69 5.36,51.69 4.72,52.32 3.41,52.32 LED2.C
  Bottom 0.152: v14.63,37.01 14.63,51.64 v14.58,51.69
IO05  (via drill 0.33)
  Top 0.152: IC3.37 19.66,31.34 v19.69,31.32
  Bottom 0.152: v19.69,31.32 19.69,44.81 19.38,45.11 19.38,49.45 20.19,50.27 20.19,51.79 CON2.5
IO06  (via drill 0.33)
  Top 0.152: IC3.40 20.46,28.94 v20.55,29.03 | v20.52,44.53 19.3,44.53 18.75,45.09 18.75,50.7 CON2.6
  Bottom 0.152: v20.55,29.03 20.55,44.5 v20.52,44.53
LIMIT_X
  Top 0.152: IC3.26 24.26,37.06 24.54,37.34 29.24,37.34 31.39,35.18 42.04,35.18 43.13,35.18 43.41,35.46 43.41,38.05 43.87,38.51 46.89,38.51 47.4,38 52.65,38 52.91,37.74 52.91,36.98 U6.8
LIMIT_Y
  Top 0.152: IC3.25 25.06,36.61 25.15,36.7 25.25,36.8 29.21,36.8 31.22,34.8 31.52,34.49 43.59,34.49 44.02,34.93 44.02,37.77 44.25,38 46.81,38 46.91,37.9 U6.6
LIMIT_Z
  Top 0.152: U7.8 40.69,38.1 40.69,38.25 40.03,38.91 19.99,38.91 19.51,38.43 19.51,38.28 19.51,35.59 IC3.32
MISO  (via drill 0.33)
  Top 0.152: U1.16 44.47,27.06 45.49,27.06 45.72,26.82 45.72,25.15 44.81,24.23 44.53,23.95 34.19,23.95 v33.73,24.41 | 33.36,24.78 33.2,24.94 30.51,24.94 v30.2,25.25 | 33.36,24.78 v33.73,24.41 | v19.48,27.23 v26.52,27.23 | v19.48,25.5 19.48,23.97 IC3.2 | MISO.TP 35.84,28.5 v35.28,27.94 | 33.36,24.78 v33.73,24.41
  Bottom 0.152: v30.2,25.25 29.08,25.25 27.08,27.25 26.54,27.25 v26.52,27.23 | v19.48,25.5 v19.48,27.23 | v35.28,27.94 35.28,25.96 v33.73,24.41
MOSI  (via drill 0.33)
  Top 0.152: v30.15,24.31 32.94,24.31 33.68,23.57 47.19,23.57 47.63,24 47.63,26.67 48.22,27.27 48.66,27.71 U1.6 49.52,27.69 MOSI.TP | v26.95,26.16 19.02,26.16 18.52,25.65 18.52,24.08 IC3.1
  Bottom 0.152: v30.15,24.31 28.8,24.31 v26.95,26.16
MOTOR  (via drill 0.33)
  Top 0.152: v14.91,26.34 15.11,26.54 IC3.43
  Top 0.254: v14.91,12.32 18.57,12.32 19.89,12.32 21.13,13.56 25.47,13.56 U5.1
  Bottom 0.254: v14.91,12.32 v14.91,26.34
MS1  (via drill 0.33)
  Top 0.152: U2.5 60.65,48.73 v60.63,48.74 | v60.68,25.83 60.68,16.64 v60.66,16.61 | v60.68,13.87 62.75,13.87 U4.5 | IC3.20 30.7,32.14 31.42,32.87 48.97,32.87 51.23,35.13 54.46,35.13 55.68,36.35 56.21,36.88 60.05,36.88 60.33,36.6 v60.63,36.6 | U3.5 60.67,31.38 v60.63,31.37
  Bottom 0.152: v60.63,36.6 v60.63,31.37 | v60.63,31.37 60.63,30.53 | 60.63,30.53 60.63,25.93 v60.68,25.83 | v60.63,36.6 60.63,37.11 | 60.63,37.11 v60.63,48.74 | v60.66,16.61 60.66,13.89 v60.68,13.87 | v60.63,36.6 60.63,37.11 | v60.63,31.37 60.63,30.53
MS2  (via drill 0.33)
  Top 0.152: U4.6 61.46,13.2 v61.42,13.16 | v61.44,25.07 v61.44,17.4 | v61.44,48.08 U2.6 | IC3.19 31.11,31.34 31.95,32.18 47.7,32.18 v47.73,32.16 | v47.78,38.71 58.95,38.71 59.23,38.43 61.09,38.43 v61.44,38.79 | U3.6 61.49,30.73 v61.44,30.68
  Bottom 0.152: v61.42,13.16 61.42,17.37 v61.44,17.4 | 61.44,31.9 61.44,31.14 | 61.44,31.14 v61.44,30.68 | v61.44,30.68 v61.44,25.07 | 61.44,32.16 61.44,31.9 | v61.44,38.79 61.44,32.16 | v61.44,38.79 61.44,39.32 | 61.44,39.32 v61.44,48.08 | 61.44,32.16 61.44,31.9 | v47.73,32.16 47.73,38.66 v47.78,38.71 | v61.44,38.79 61.44,39.32 | 61.44,31.14 v61.44,30.68
N$1
  Top 0.254: U2.4 60.12,49.38 59.61,48.87 59.61,48.29 59.41,48.08 58.96,48.08 C2.2
N$2
  Top 0.305: U2.1 61.78,51.33 61.19,51.92 61.19,52.63 60.53,53.29 57.07,53.29 56.92,53.14 56.92,52.51
  Top 0.406: C3.1 56.92,52.51
N$3
  Top 0.305: U2.2 61.64,50.68 60.63,51.69 58.7,51.69 58.7,51.9 C3.2
N$4
  Top 0.305: U2.3 58.62,50.03 C4.1
N$5
  pour Top (rank 2, no thermals): 68.63,47.68 68.63,46.84 71.98,46.84 74.45,44.63 82.68,43.36 82.68,47.68
N$6
  pour Top (rank 3, no thermals): 68.48,45.69 82.73,45.69 82.73,39.95 73.69,39.95 68.99,45.16 68.48,45.16
N$7
  pour Top (rank 2, no thermals): 68.63,47.85 68.63,48.46 71.98,48.46 73.61,50.09 73.61,50.11 74.42,50.93 82.73,51.36 82.7,47.9
N$8
  pour Top (rank 3, no thermals): 68.33,49.66 82.73,49.66 82.73,55.5 72.8,55.5 68.86,50.29 68.33,50.29
N$9
  Top 0.254: U2.8 60.82,46.78 60.6,46.56 60.6,45.72 60.3,45.42 58.58,45.42 R1.1
N$10
  Top 0.254: 58.71,30.81 C6.2 58.99,31.39 59.64,31.39 60.27,32.03 U3.4
N$11
  Top 0.254: U3.1 61.03,35.71 60.63,35.71 60.12,35.71 59.51,36.32 56.95,36.32 56.77,36.14 56.77,35.34 C7.1
N$12
  Top 0.254: U3.2 62.07,33.33 60.5,34.9 58.74,34.9 C7.2
N$13
  Top 0.254: U3.3 58.67,32.68 C8.1
N$14
  pour Top (rank 2, no thermals): 68.63,30.33 68.63,29.49 71.98,29.49 74.45,27.28 82.68,26.01 82.68,30.33
N$15
  pour Top (rank 3, no thermals): 68.48,28.35 82.73,28.35 82.73,22.61 73.69,22.61 68.99,27.81 68.48,27.81
N$16
  Top 0.152: C17.2 4.97,24.23 3.23,24.23 SJ1.2 1.8,24.23
N$17
  pour Top (no thermals): 68.78,48.92 70.43,50.04 70.46,50.04 70.46,48.46 68.78,48.46
N$18
  pour Top (rank 2, no thermals): 68.63,30.51 68.63,31.11 71.98,31.11 73.61,32.74 73.61,32.77 74.42,33.58 82.73,34.01 82.7,30.56
N$19
  Top 0.254: U1.11 42.85,30.3 42.72,30.43 R4.2
N$20  (via drill 0.33)
  Top 0.152: U1.10 50.72,30.31 v51.44,29.59 | v51.44,32.33 51.44,32.62 R5.2
  Bottom 0.152: v51.44,29.59 v51.44,32.33
N$21
  Top 0.152: U1.20 41.91,24.46 41.61,24.77 41.61,25.44 R6.2
N$22
  pour Top (rank 3, no thermals): 68.33,32.31 82.73,32.31 82.73,38.15 72.8,38.15 68.86,32.94 68.33,32.94
N$23
  pour Top (no thermals): 68.61,29.44 68.61,29.67 70.51,29.67 70.51,28.07 70.15,28.07 68.73,29.49 68.66,29.49
N$24
  pour Top (no thermals): 68.78,31.57 70.43,32.69 70.46,32.69 70.46,31.11 68.78,31.11
N$25
  Top 0.152: R9.1 59.16,29.43
  Top 0.305: 59.16,29.43 U3.8
N$26
  Top 0.254: C10.2 58.62,13.03 60.17,14.58 61.72,14.58 61.77,14.53 62.74,14.53 U4.4
N$27  (via drill 0.33)
  Top 0.254: C11.1 55.7,17.6 v55.45,17.35 | v62.81,17.37 62.81,16.5 U4.1
  Bottom 0.254: v55.45,17.35 55.45,17.4 56.49,18.44 61.75,18.44 v62.81,17.37
N$28
  Top 0.254: U4.2 60.12,15.8 58.93,16.99 58.93,17.16 C11.2
N$29
  Top 0.254: U4.3 58.64,15.15 C12.1
N$30
  pour Top (rank 2, no thermals): 68.71,12.8 68.71,11.96 72.06,11.96 74.52,9.75 82.75,8.48 82.75,12.8
N$31
  pour Top (rank 3, no thermals): 68.55,10.82 82.8,10.82 82.8,5.08 73.76,5.08 69.06,10.29 68.55,10.29
N$32
  pour Top (rank 2, no thermals): 68.71,12.98 68.71,13.59 72.06,13.59 73.69,15.21 73.69,15.24 74.5,16.05 82.8,16.48 82.78,13.03
N$33
  pour Top (rank 3, no thermals): 68.4,14.78 82.8,14.78 82.8,20.62 72.87,20.62 68.94,15.42 68.4,15.42
N$34
  pour Top (no thermals): 68.68,11.91 68.68,12.14 70.59,12.14 70.59,10.54 70.23,10.54 68.81,11.96 68.73,11.96
N$35
  pour Top (no thermals): 68.86,14.05 70.51,15.16 70.54,15.16 70.54,13.59 68.86,13.59
N$36
  Top 0.254: U4.8 62.17,11.9 60.93,10.67 58.56,10.67 R12.1
N$37
  Top 1.016: LED1.A 1.26,48.74 R16.1
N$38
  pour Top (no thermals): 40.79,16.33 40.79,6.96 55.02,6.96 55.02,16.33
N$39
  Top 0.254: R13.1 29.75,45.8 31.01,45.8 31.34,45.47 31.34,44.17 32.87,42.65 52.55,42.65 53.01,43.1 U6.1
N$40
  Top 0.406: X4.1 11.99,7.82 12.32,7.49 13.07,7.49 L2.1 14.99,7.38 C21.2
N$41  (via drill 0.33)
  Top 0.254: R14.1 27.15,46.01 v27.15,47.24 | v47.93,47.37 U6.3
  Bottom 0.254: v27.15,47.24 27.28,47.37 v47.93,47.37
N$42  (via drill 0.33)
  Top 0.152: X4.2 11.37,7.02 v11.76,6.63 | v6.35,12.27 6.15,12.27 6.02,12.4 6.02,14.52 IC2.16
  Bottom 0.152: v11.76,6.63 6.6,6.63 5.77,7.47 5.77,11.68 v6.35,12.27
N$43  (via drill 0.33)
  Top 0.254: R15.1 24.61,46.01 v24.61,48.29 | v40.77,48.21 40.69,48.13 U7.1
  Bottom 0.254: v24.61,48.29 24.69,48.21 v40.77,48.21
N$45  (via drill 0.33)
  Top 0.152: X4.3 10.9,6.22 v11.63,5.49 | v4.98,12.32 4.98,14.16 IC2.15
  Bottom 0.152: v11.63,5.49 11.61,5.49 11.23,5.87 6.05,5.87 5.18,6.73 5.18,12.12 v4.98,12.32
N$47  (via drill 0.33)
  Top 0.254: v35.56,44.15 35.61,44.2 U7.3 | v22.05,47.7 22.05,45.98 R17.1
  Bottom 0.254: v35.56,44.15 35.56,44.93 34.54,45.95 23.8,45.95 v22.05,47.7
N$48
  Top 0.254: LED2.A 1.29,54.23 R19.1
N$49
  Top 0.254: IC2.17 6.65,16.13 6.17,16.61 3.08,16.61 C16.2
N$50
  Top 1.778: U5.3 24.57,4.99 24.64,4.93 | 25.43,6.07 25.86,6.07 27.81,8.03 32.77,8.03 X5.P$4
  Top 2.54: 25.43,6.07 25.43,4.95 24.74,4.27 24.64,4.37 24.64,4.93 24.64,5.49 24.56,5.56
N$51  (via drill 3.17)
  other vias: 84.94,2.77
N$52
  Top 0.152: IC2.3 12.5,20.27 12.5,19.84 12.09,19.43 3.8,19.43 3.53,19.43 2.34,20.62 2.34,21.16 TP1.TP
N$53  (via drill 0.33)
  Top 0.152: IC2.2 13.15,19.4 12.62,18.87 5.41,18.87 v5.21,18.67 | v4.09,22.4 3.58,22.91 1.78,22.91 1.63,23.06 1.63,23.77 1.68,23.83 1.68,24.08 1.63,24.13 SJ1.1
  Bottom 0.152: v5.21,18.67 5.21,21.29 v4.09,22.4
N$54  (via drill 0.33)
  Top 0.152: v17.37,17.75 17.45,17.83 23.55,17.83 23.67,17.7 23.46,17.7 R20.2 | v17.4,22.71 14.72,22.71 IC2.1
  Bottom 0.152: v17.37,17.75 17.37,22.68 v17.4,22.71
N$55  (via drill 0.33)
  Top 0.152: v18.31,15.67 R21.2 | v11.23,23.47 11.23,21.81 IC2.5 | v13.92,23.85 17.04,23.85 v17.45,24.26
  Bottom 0.152: v18.31,15.67 18.31,22.96 18.31,23.04 18.31,23.39 v17.45,24.26 | v13.92,23.85 11.61,23.85 v11.23,23.47
N$56
  Top 0.152: R22.1 17.3,1.29
  Top 1.016: POWER_LED.A 17.35,1.24 R22.1
N$57
  Top 0.152: IC3.8 24.26,22.81 25.12,21.95 25.12,20.5 Q1.P$1
N$58
  Top 0.152: IC3.7 23.46,22.8 22.71,22.05 22.71,21.34 22.63,21.26 22.63,20.54 Q1.P$3
N$59  (via drill 3.17)
  other vias: 29.82,52.12
NSRST  (via drill 0.33)
  Top 0.152: IC3.4 21.06,22.86 20.55,22.35 19.28,22.35 19.08,22.15 19.08,21.24 R18.1 | R18.1 18.9,21.12 | R18.1 18.55,21.23 v16.15,21.23 | v15.57,24.82 12.73,24.82 12.14,24.23 7.01,24.23 6.99,24.21 | 6.99,24.21 6.99,23.95 7.02,23.99 C17.1 | v6.63,27.13 6.99,26.77 6.99,24.21
  Bottom 0.152: v16.15,21.23 16.15,24.23 v15.57,24.82 | 4.65,35.71 X6.8 | 4.65,35.71 JTAG.6 6.27,35.1 6.58,34.8 6.58,27.18 v6.63,27.13 | 4.65,35.71 4.7,35.71 5.36,35.05 5.51,35.05 6.55,36.09 6.55,45.92 S1.1
RESET  (via drill 0.33)
  Top 0.152: U4.7 60.76,12.55 v60.71,12.5 | v59.77,17.25 59.77,25.22 v59.72,25.27 | v59.72,47.37 62.71,47.37 U2.7 | v59.72,39.32 59.69,39.29 | U3.7 59.91,30.08 v59.72,30.28 | v59.72,39.32 59.64,39.4 | v59.72,39.32 59.54,39.5 14.22,39.5 11.66,36.93 11.66,36.63 11.66,36.53 11.66,28.85 12.37,28.14 IC3.41
  Bottom 0.152: v60.71,12.5 60.58,12.5 59.89,13.18 59.89,17.12 v59.77,17.25 | v59.72,39.32 59.72,30.78 | 59.72,30.78 v59.72,30.28 | v59.72,30.28 v59.72,25.27 | v59.72,39.32 59.72,39.9 | 59.72,39.9 v59.72,47.37 | v59.72,39.32 59.72,39.9 | 59.72,30.78 v59.72,30.28
RX
  Top 0.152: IC3.9 25.06,23 25.81,22.25 25.81,18.84 R20.1
SCK
  Top 0.152: U1.5 48.65,27.06 48.16,26.57 48.16,24 | 48.16,24 48.16,23.9 47.9,23.65 47.8,23.55 47.52,23.27 33.86,23.27 32.84,23.27 32.56,23.55 32.23,23.88 31.7,23.88 30.99,23.88 30.76,23.65 28.7,23.65 26.85,25.5 26.67,25.5 20.52,25.5 20.24,25.22 20.24,23.96 IC3.3 | SCK.TP 48.26,23.9 48.16,24
SENSE1_LEFT  (via drill 0.33)
  Top 0.152: U2.17 68.59,46.76 67.92,46.76 67.77,46.61 67.77,44.2 v66.45,42.88 | v67.46,53.82 65.68,53.82 65.61,53.75 65.61,53.95 SJ2.1
  Bottom 0.152: v66.45,42.88 66.45,43.38 67.44,44.37 67.44,53.8 v67.46,53.82
  pour Top (no thermals): 68.61,46.79 68.61,47.02 70.51,47.02 70.51,45.42 70.15,45.42 68.73,46.84 68.66,46.84
STATUS_LED  (via drill 0.33)
  Top 0.152: IC3.33 18.66,37.66 v18.42,37.9 | v18.42,43.54 5.74,43.54 v5.72,43.56 | v5.69,50.55 3.62,50.55 LED1.C
  Bottom 0.152: v18.42,43.54 v18.42,37.9 | v5.72,43.56 5.72,50.52 v5.69,50.55
STEP_X  (via drill 0.33)
  Top 0.152: U2.11 62.12,44.83 61.32,44.02 61.32,42.62 60.48,41.78 32.03,41.78 v32,41.81 | v31.8,28.09 28.51,28.09 IC3.15
  Bottom 0.152: v32,41.81 32,28.3 v31.8,28.09
STEP_Y  (via drill 0.33)
  Top 0.152: v53.01,28.7 52.96,28.65 52.96,27.94 53.34,27.56 53.8,27.1 61.09,27.1 61.46,27.48 U3.11 | v53.04,24.97 53.04,23.67 52.53,23.16 52.27,22.91 40.16,22.91 31.9,22.91 arc-90 v31.65,23.16 | v31.72,26.59 28.51,26.59 IC3.13
  Bottom 0.152: v53.01,28.7 53.01,24.99 v53.04,24.97 | v31.65,23.16 31.65,26.52 v31.72,26.59
STEP_Z  (via drill 0.33)
  Top 0.152: U4.11 62.79,9.93 63.6,9.93 63.73,9.8 63.73,7.47 60.91,4.65 v29.85,4.65 | v28.52,22.68 27.26,23.94 IC3.11
  Bottom 0.152: v29.85,4.65 28.52,5.97 v28.52,22.68
TCK  (via drill 0.33)
  Top 0.152: IC3.21 26.77,32.94 v26.7,33.02 | 26.57,40.54 26.57,40.56 26.57,40.61 v26.64,40.61 26.39,40.36 14.22,40.36 10.49,36.63 10.49,36.55 10.49,30.38 10.11,30 7.82,30 JTAG.1 7.67,30.02 6.63,31.06 4.83,31.06 4.22,30.45 4.22,29.54 3.66,28.98 3.66,28.96 3.68,28.93 2.41,28.93 X6.1 2.92,28.85 3.38,28.4
  Bottom 0.152: v26.7,33.02 26.7,40.44 v26.64,40.61
TDI  (via drill 0.33)
  Top 0.152: IC3.24 25.86,34.21 v25.22,33.58 | X6.5 2.36,39.85 3.3,39.85 4.19,38.96 6.86,38.96 7.8,39.9 JTAG.9 8.1,40.49 12.09,40.49 12.93,40.49 13.97,41.53 21.08,41.53 v22.12,42.57
  Bottom 0.152: v25.22,33.58 25.22,39.47 v22.12,42.57
TDO  (via drill 0.33)
  Top 0.152: IC3.23 27.49,35.54 v27.84,35.89 | 27.66,41.22 27.71,41.17 v27.71,41.12 27.61,41.22 26.01,41.22 25.58,40.79 14.22,40.79 10.06,36.63 10.06,33.58 9.91,33.43 9.17,32.69 7.92,32.69 JTAG.3 7.14,32.56 6.17,31.6 6.12,31.55 3.35,31.55 3.3,31.6 | X6.2 3.3,31.6 | 3.3,31.6 3.58,31.6 3.89,31.29
  Bottom 0.152: v27.84,35.89 27.84,41 v27.71,41.12
THERMAL  (via drill 0.33 pad 0.41)  (4 unrouted)
  Bottom 0.152: v64.41,12.6 65.41,12.6 U4.THERMAL | U4.THERMAL 65.68,13.31 65.53,13.46 65.53,13.03 U4.THERMAL | v64.34,30.12 65.41,30.12 U3.THERMAL | U3.THERMAL 65.25,30.4 64.24,29.39 64.67,29.39 U3.THERMAL | v65.58,46.74 65.61,47.68 U2.THERMAL | U2.THERMAL 66.57,47.75 65.74,47.63 66.14,47.29 | 65.68,48.72 65.25,49.15 65.25,48.18 U2.THERMAL
  other vias: 64.34,49.78 66.68,49.83 65.63,49.83 65.02,49.05 66.32,49 64.26,46.66 66.65,46.71 65.05,46 64.29,45.62 66.14,46.05 66.68,45.54 64.21,48.13 66.68,48.23 65.58,48.16 64.85,47.47 66.37,47.47 66.32,32.33 64.97,32.33 64.44,31.62 66.9,31.6 66.17,29.39 65.15,29.41 64.41,28.52 66.95,28.5 66.29,30.86 65.13,30.78 66.9,30.12 66.45,14.88 65.05,14.88 64.41,14.12 67.08,14.12 66.45,11.84 65.05,11.84 64.41,11.07 67.08,11.07 66.45,13.36 65.05,13.36 67.08,12.6 65.68,12.73 65.68,11.2 65.68,14.25 65.68,28.5 65.63,31.62
  pour Bottom: 63.96,55.12 67.28,55.12 67.28,24.66 56.74,24.66 56.74,55.22 63.96,55.22
  pour Bottom: 61.29,9.73 61.29,17.83 67.92,17.83 67.92,9.73
TMS  (via drill 0.33)
  Top 0.152: IC3.22 28.46,34.81 v28.47,34.82 | X6.3 3.45,34.34 3.94,33.86 6.55,33.86 JTAG.5 7.82,35.08 8.89,35.08 9.17,35.36 9.58,35.76 9.58,36.58 14.22,41.22 25.4,41.22 25.86,41.68 27.08,41.68 27.38,41.99 28.47,41.99 v28.5,41.96
  Bottom 0.152: v28.47,34.82 28.47,34.85 28.8,35.18 28.8,41.66 v28.5,41.96
TX
  Top 0.152: IC3.10 25.86,22.99 26.37,22.48 26.37,17.21 R21.1
V+  (via drill 0.33, 0.51)
  Top 0.152: U4.21 68.68,14.5 | U4.16 68.68,11.25
  Top 0.254: 69.52,46.13 v69.7,46.13 | v69.72,49.38 69.44,49.38 | 69.44,49.38 | 69.52,28.78 v69.7,28.78 | 69.52,28.78 | v69.7,32.03 69.44,32.03 | C8.2 56.58,32.88 v55.58,33.88 | v54.58,49.63 56.33,49.63 C4.2 | v69.77,14.5 69.52,14.5 | v69.77,11.25 69.6,11.25
  Top 0.381: 69.44,49.38 U2.21 | U2.16 69.52,46.13 | U3.21 69.44,32.03 | U3.16 69.52,28.78 | 68.68,14.5 69.52,14.5 | 68.68,11.25 69.6,11.25
  Top 0.406: L1.1 45.82,21.31 | C12.2 54.71,15.32 53.98,16.05 53.98,18.42 v53.95,18.44
  Top 2.54: L1.1 45.52,21.21 C14.+
  Bottom 0.254: v55.58,33.88 55.58,43.56 54.64,44.5 54.64,49.58 | 54.64,49.58 v54.58,49.63 | 54.64,49.58 54.64,49.63 | v69.72,49.38 68.78,50.32
  Bottom 0.406: v53.95,18.44 53.95,18.77 54.15,18.97 | 54.64,49.63 54.64,53.39 56.26,55.02 69.44,55.02 69.98,54.48 69.98,50.11 69.8,49.94 70.05,49.94 70.08,49.91 70.08,49.73 v69.72,49.38
  pour Bottom (rank 2, no thermals): 42.6,18.11 42.6,24.51 67.41,24.51 67.41,51.08 73.79,51.08 73.79,9.04 68.12,9.04 68.12,18.03 42.67,18.03 arc-90
VREF
  Bottom 0.152: JTAG.4 3.35,32.56 2.92,32.99 2.36,32.99 X6.7
VREF_X  (via drill 0.33)
  Top 0.152: U2.12 62.74,44.15 v62.74,43.48 | v62.74,37.62 62.64,37.52 58.37,37.52 56.01,37.52 54.23,35.74 50.55,35.74 48.46,33.66 45.47,33.66 v45.42,33.71 | v45.36,29.64 43.68,29.64 U1.12
  Bottom 0.152: v62.74,37.62 v62.74,43.48 | v45.42,33.71 45.42,29.69 v45.36,29.64
VREF_Y
  Top 0.152: U1.9 50.53,29.66 52.98,27.2 53.42,26.77 61.21,26.77 61.27,26.83 U3.12
VREF_Z  (via drill 0.33)
  Top 0.152: U1.19 v44.78,25.1 | v51.69,25.07 51.94,25.07 52.6,25.73 53.52,25.73 54.13,25.12 54.13,20.02 53.26,19.15 53.26,15.95 54.53,14.68 54.84,14.38 v55.25,14.38 | v62.76,8.61 v62.77,8.61 U4.12
  Bottom 0.152: v44.78,25.1 44.81,25.07 v51.69,25.07 | v55.25,14.38 58.45,11.18 61.29,11.18 62.76,9.7 v62.76,8.61

### Text on the board
Top: rStep | v2 | (c) Reza Naima 2010
tPlace: RESET | X | 1B 1A 2A 2B | 1B 1A 2A 2B | Y | 1B 1A 2A 2B | Z | SPINDLE | STEPPER | GND | GND | GND | POWER
tStop: rStep | (c) Reza Naima 2010